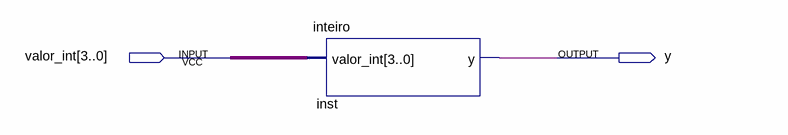
[diagram p0: schematic sheet]
// Quartus schematic estrutura_decisao.bdf as structural Verilog: 1 symbols, 2 pins
module estrutura_decisao (
  input  [3:0] valor_int,
  output y
);

  inteiro inst (.valor_int(valor_int), .y(y));
endmodule
